# Altium project BMS.PrjPcb
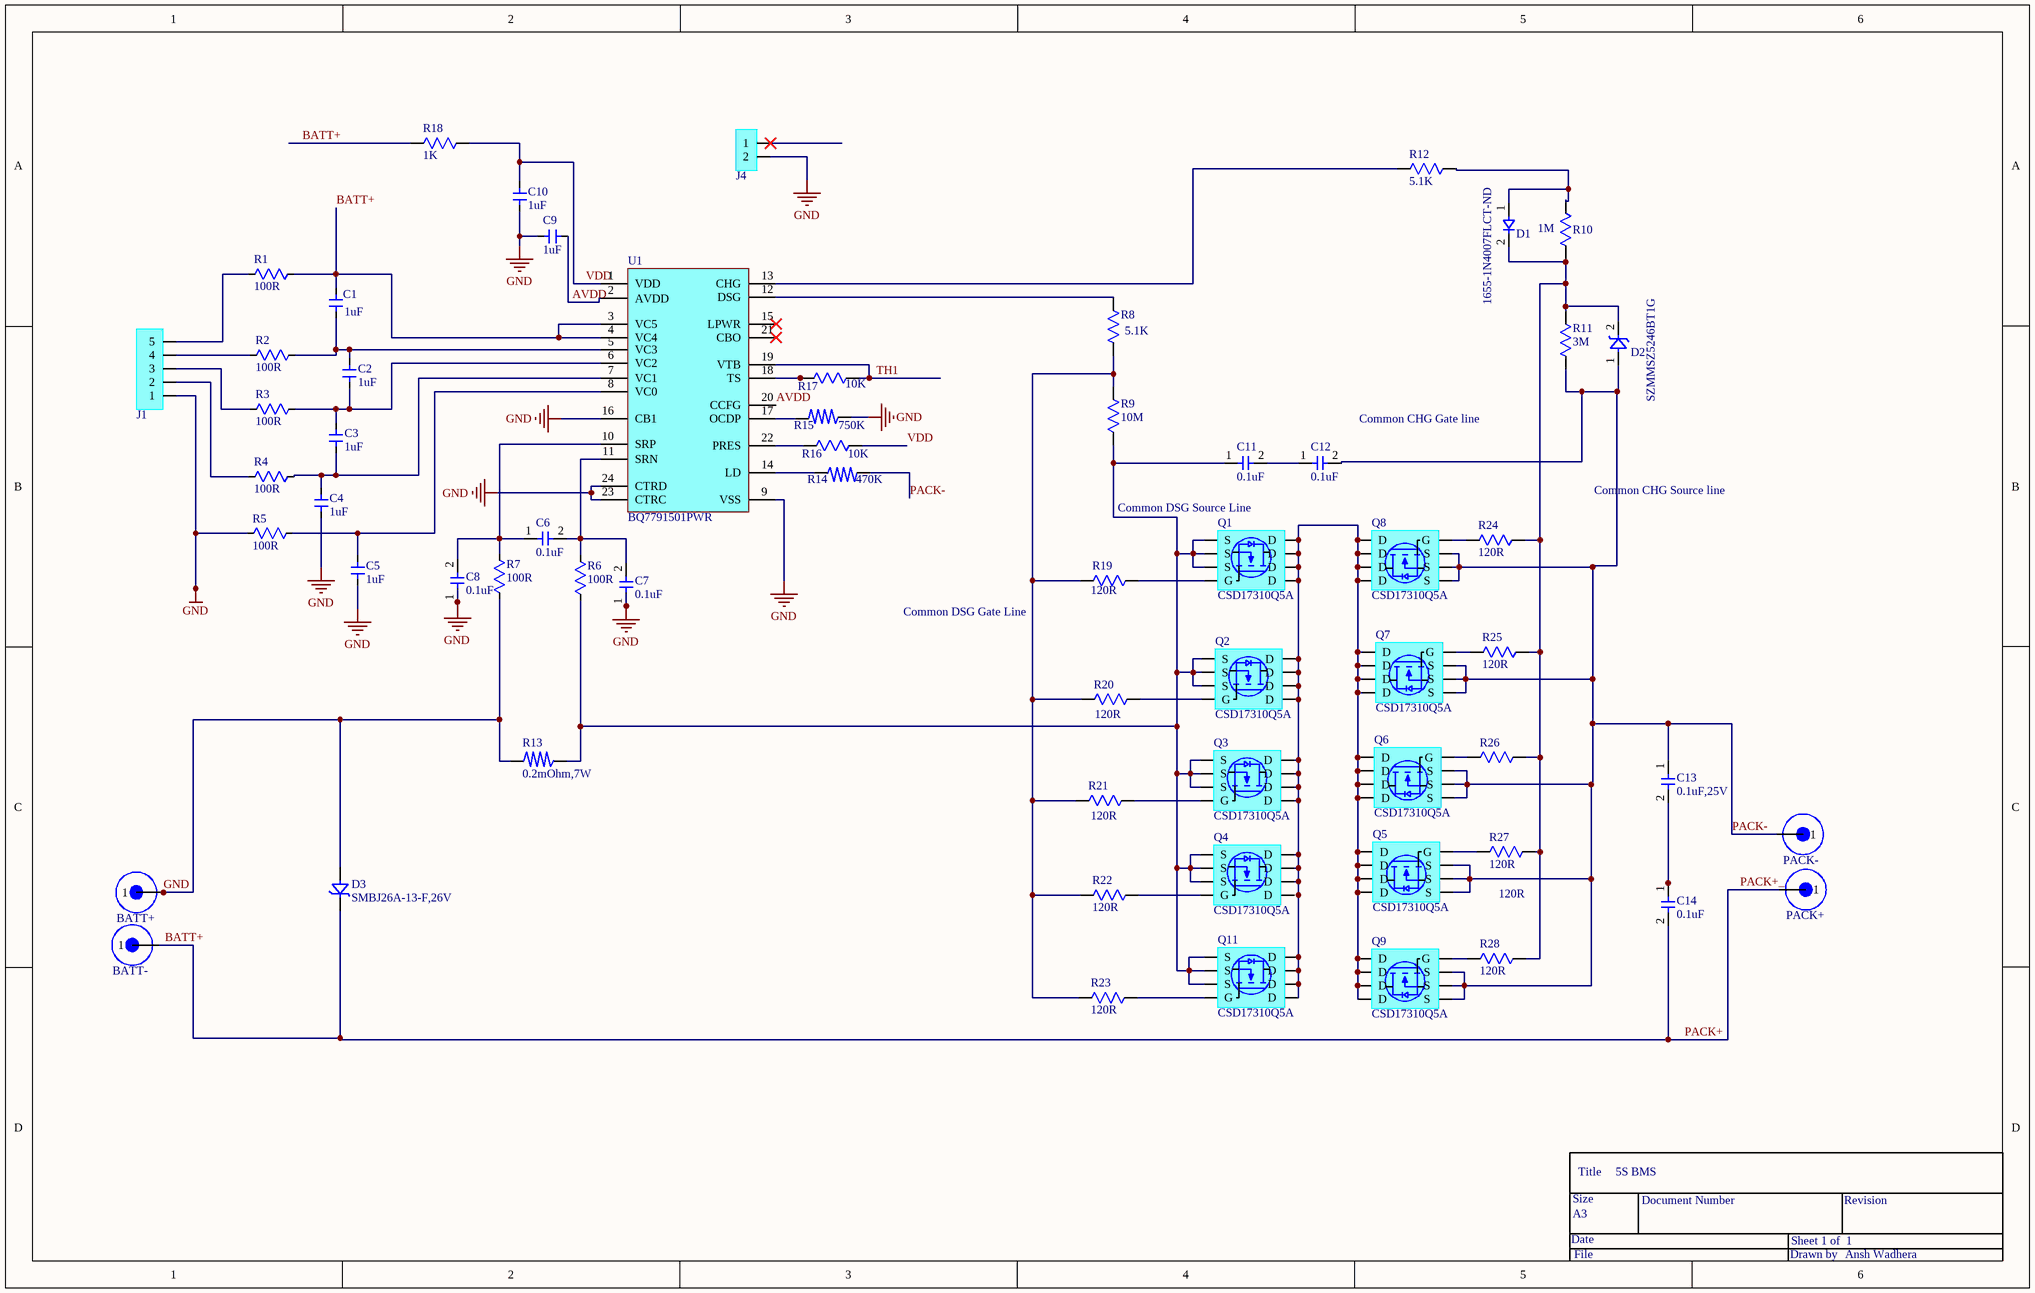
[diagram p0: BMS.SchDoc]
1 sheet, 62 parts. Net scope: global (net labels, ports and power ports of the same name join across sheets).
Board files: BMSrev.PcbDoc, BMSrev2(NEW).PcbDoc, BMS_Rev3.PcbDoc, BMS_Rev4.PcbDoc

## Sheet BMS.SchDoc
size B; SheetNumber: 1; SheetTotal: 1

### Parts
BATT+  Pads  [PadsPack]  (value not drawn)
BATT-  Pads  [PadsPack]  (value not drawn)
C1  1uF  [WCAP-CSGP_0805_L2W1.25H0.6_Wave]
C2  1uF  [WCAP-CSGP_0805_L2W1.25H0.6_Wave]
C3  1uF  [WCAP-CSGP_0805_L2W1.25H0.6_Wave]
C4  1uF  [WCAP-CSGP_0805_L2W1.25H0.6_Wave]
C5  1uF  [WCAP-CSGP_0805_L2W1.25H0.6_Wave]
C6  0.1uF  [WCAP-CSGP_0603_L1.6W0.8H0.8_Wave]
C7  0.1uF  [WCAP-CSGP_0603_L1.6W0.8H0.8_Wave]
C8  0.1uF  [WCAP-CSGP_0603_L1.6W0.8H0.8_Wave]
C9  1uF  [WCAP-CSGP_0805_L2W1.25H0.6_Wave]
C10  1uF  [WCAP-CSGP_0805_L2W1.25H0.6_Wave]
C11  0.1uF  [WCAP-CSGP_0603_L1.6W0.8H0.8_Wave]
C12  0.1uF  [WCAP-CSGP_0603_L1.6W0.8H0.8_Wave]
C13  0.1uF,25V  [WCAP-CSGP_0603_L1.6W0.8H0.8_Wave]
C14  0.1uF  [WCAP-CSGP_0603_L1.6W0.8H0.8_Wave]
D1  1655-1N4007FLCT-ND  [Diode(SOD)]
D2  SZMMSZ5246BT1G  [Zener(SOD123)]
D3  SMBJ26A-13-F,26V  [DIOM5336X250N]
J1  J1
J4  Header  [Header(4pin)]  (value not drawn)
PACK+  Pads  [PadsPack]  (value not drawn)
PACK-  Pads  [PadsPack]  (value not drawn)
Q1  CSD17310Q5A  [MOSFET_CSD19531Q5A]
Q2  CSD17310Q5A  [MOSFET_CSD19531Q5A]
Q3  CSD17310Q5A  [MOSFET_CSD19531Q5A]
Q4  CSD17310Q5A  [MOSFET_CSD19531Q5A]
Q5  CSD17310Q5A  [MOSFET_CSD19531Q5A]
Q6  CSD17310Q5A  [MOSFET_CSD19531Q5A]
Q7  CSD17310Q5A  [MOSFET_CSD19531Q5A]
Q8  CSD17310Q5A  [MOSFET_CSD19531Q5A]
Q9  CSD17310Q5A  [MOSFET_CSD19531Q5A]
Q11  CSD17310Q5A  [MOSFET_CSD19531Q5A]
R1  100R  [RESC3115X65N]
R2  100R  [RESC3115X65N]
R3  100R  [RESC3115X65N]
R4  100R  [RESC3115X65N]
R5  100R  [RESC3115X65N]
R6  100R  [RESC3115X65N]
R7  100R  [RESC3115X65N]
R8  5.1K  [Resistor0805]
R9  10M  [Resistor0805]
R10  1M  [Resistor0805]
R11  3M  [Resistor0805]
R12  5.1K  [Resistor0805]
R13  0.2mOhm,7W  [CSR]
R14  470K  [Resistor0805]
R15  750K  [Resistor0805]
R16  10K  [Resistor0805]
R17  10K  [Resistor0805]
R18  1K  [Resistor0805]
R19  120R  [Resistor0805]
R20  120R  [Resistor0805]
R21  120R  [Resistor0805]
R22  120R  [Resistor0805]
R23  120R  [Resistor0805]
R24  120R  [Resistor0805]
R25  120R  [Resistor0805]
R26  120R  [Resistor0805]
R27  120R  [Resistor0805]
R28  120R  [Resistor0805]
U1  BQ7791501PWR  [BQ77915]

### Nets
GND: BATT+.1 C4.2 C5.1 C7.1 C8.1 C9.1 C10.1 D3.1 J1.1 J4.2 R5.1 R7.1 R13.1 R15.2 U1.9(VSS) U1.16(CB1) U1.23(CTRC) U1.24(CTRD)
AVDD: C9.2 U1.2(AVDD) U1.20(CCFG)
BATT+: BATT-.1 C1.2 C14.2 D3.2 PACK+.1 R1.2 R18.1 U1.3(VC5) U1.4(VC4)  [also labelled PACK+, PACK+_]
PACK-: C12.2 C13.1 D2.1 PACK-.1 Q5.S Q6.S Q7.S Q8.S Q9.S R11.1 R14.1
TH1: R17.2 U1.19(VTB)
VDD: C10.2 R16.2 R18.2 U1.1(VDD)
NetC1_1: C1.1 C2.2 R2.2 U1.5(VC3)
NetC2_1: C2.1 C3.2 R3.2 U1.6(VC2)
NetC3_1: C3.1 C4.1 R4.2 U1.7(VC1)
NetC5_2: C5.2 R5.2 U1.8(VC0)
NetC6_1: C6.1 C8.2 R7.2 U1.10(SRP)
NetC6_2: C6.2 C7.2 R6.2 U1.11(SRN)
NetC11_1: C11.1 Q1.S Q2.S Q3.S Q4.S Q11.S R6.1 R9.1 R13.2
NetC11_2: C11.2 C12.1
NetC13_2: C13.2 C14.1
NetD1_1: D1.1 R10.2 R12.2
NetD1_2: D1.2 D2.2 R10.1 R11.2 R24.2 R25.2 R26.2 R27.2 R28.2
NetJ1_2: J1.2 R4.1
NetJ1_3: J1.3 R3.1
NetJ1_4: J1.4 R2.1
NetJ1_5: J1.5 R1.1
NetQ1_D: Q1.D Q2.D Q3.D Q4.D Q5.D Q6.D Q7.D Q8.D Q9.D Q11.D
NetQ1_G: Q1.G R19.2
NetQ2_G: Q2.G R20.2
NetQ3_G: Q3.G R21.2
NetQ4_G: Q4.G R22.2
NetQ5_G: Q5.G R27.1
NetQ6_G: Q6.G R26.1
NetQ7_G: Q7.G R25.1
NetQ8_G: Q8.G R24.1
NetQ9_G: Q9.G R28.1
NetQ11_G: Q11.G R23.2
NetR8_1: R8.1 R9.2 R19.1 R20.1 R21.1 R22.1 R23.1
NetR8_2: R8.2 U1.12(DSG)
NetR12_1: R12.1 U1.13(CHG)
NetR14_2: R14.2 U1.14(LD)
NetR15_1: R15.1 U1.17(OCDP)
NetR16_1: R16.1 U1.22(PRES)
NetR17_1: R17.1 U1.18(TS)

Not connected (* = marked no-connect by the designer): J4 1*; U1 15(LPWR)* 21(CBO)*

### Notes on the sheet
- (near C12) Common CHG Gate line
- Common CHG Source line
- Common DSG Source Line
- Common DSG Gate Line
- Title
- 5S BMS
- Date
- Size
- A3
- Document Number
- Sheet 1 of  1
- Revision
- File
- Drawn by
- Ansh Wadhera

### Library data of the parts
C1-C5 C9 C10 = C1u0805: Ceramic Capacitor, Multilayer, Ceramic, 16V, 10% +Tol, 10% -Tol, X7R, 15% TC, 1uF, Surface Mount, 0805; Manufacturer: Walsin Technologies; Manufacturer Part Number: 0805B105K160CT; Multilayer: Yes; Supplier: Digikey; Supplier Part Number: 1292-0805B105K160CT-ND; RoHS: Yes; Category: Ceramic Capacitors; Stock: 4261; Pricing: 1=0.1, 10=0.05, 100=0.0295, 1000=0.01909 (USD); Mounting Technology: Surface Mount; Pins: 2; Dielectric Material: Ceramic; Package Shape: Rectangular; Case/Package: 0805; Terminal Finish: Nickel; Min Operating Temperature: -55°C; Max Operating Temperature: 125°C; JESD-609 Code: e3; Value: 1uF; Capacitor Type: Ceramic; Tolerance  (fill in as +-): 10%; Package Style: SMTMeter; Packaging: Tape and Reel; Tolerance (fill in as +-): 10%; Rated DC Voltage (URdc): 16V; Temperature Characteristics Code: X7R; Termination: Wraparound; Length: 2mm; Width: 1.25mm; Height: 1.25mm; RoHS Compliant: Yes; Reach SVHC Compliant: Yes; ComponentLink1URL: https://datasheet.ciiva.com:443/pdfs/VipMasterIC/IC/WATC/WATC-S-A0009550342/WATC-S-A0009550342-1.pdf?src-supplier=IHS+Markit; ComponentLink1Description: https://datasheet.ciiva.com:443/pdfs/VipMasterIC/IC/WATC/WATC-S-A0009550342/WATC-S-A0009550342-1.pdf?src-supplier=IHS+Markit; ComponentLink2URL: http://www.farnell.com/datasheets/2340522.pdf?src-supplier=Farnell; ComponentLink2Description: http://www.farnell.com/datasheets/2340522.pdf?src-supplier=Farnell; ComponentLink3URL: https://datasheet.octopart.com/0805B105K160CT-Walsin-Technologies-datasheet-128065749.pdf?src-supplier=Future+Electronics; ComponentLink3Description: https://datasheet.octopart.com/0805B105K160CT-Walsin-Technologies-datasheet-128065749.pdf?src-supplier=Future+Electronics; ComponentLink4URL: https://datasheet.octopart.com/0805B105K160CT-Walsin-Technologies-datasheet-85392065.pdf?src-supplier=Element14; ComponentLink4Description: https://datasheet.octopart.com/0805B105K160CT-Walsin-Technologies-datasheet-85392065.pdf?src-supplier=Element14; ComponentLink5URL: https://www.verical.com/server-webapp/html/getDatasheet?partID=137112&src-supplier=Verical; ComponentLink5Description: https://www.verical.com/server-webapp/html/getDatasheet?partID=137112&src-supplier=Verical; ComponentLink6URL: https://datasheet.octopart.com/0805B105K160CT-Walsin-Technologies-datasheet-62066062.pdf?src-supplier=TME; ComponentLink6Description: https://datasheet.octopart.com/0805B105K160CT-Walsin-Technologies-datasheet-62066062.pdf?src-supplier=TME; ComponentLink7URL: https://datasheet.octopart.com/0805B105K160CT-Walsin-Technologies-datasheet-136037192.pdf?src-supplier=TECHDesign; ComponentLink7Description: https://datasheet.octopart.com/0805B105K160CT-Walsin-Technologies-datasheet-136037192.pdf?src-supplier=TECHDesign
C6-C8 C11-C14 = C0.1uF0603: Ceramic Capacitor, Multilayer, Ceramic, 16V, 10% +Tol, 10% -Tol, X7R, 15% TC, 0.1uF, Surface Mount, 0603; Manufacturer: Yageo; Manufacturer Part Number: CC0603KRX7R7BB104; Value: 100nF; Multilayer: Yes; Supplier: Future Electronics; Supplier Part Number: 2938116; RoHS: Yes; Category: Ceramic Capacitors; Stock: 532000; Pricing: 4000=0.0024, 16000=0.0023, 40000=0.0022, 100000=0.0022, 160000=0.0021 (USD); Mounting Technology: Surface Mount; Pins: 2; Dielectric Material: Ceramic; Package Shape: Rectangular; Case/Package: 0603; Terminal Finish: Nickel; Min Operating Temperature: -55°C; Max Operating Temperature: 125°C; JESD-609 Code: e3; Capacitor Type: Ceramic; Tolerance  (fill in as +-): 10%; Package Style: SMTMeter; Packaging: Tape and Reel; Tolerance (fill in as +-): 10%; Rated DC Voltage (URdc): 16V; Temperature Characteristics Code: X7R; Termination: Wraparound; Length: 1.6mm; Width: 0.8mm; Height: 0.8mm; Reach SVHC Compliant: Yes; RoHS Compliant: Yes; ComponentLink1URL: https://datasheet.ciiva.com:443/pdfs/VipMasterIC/IC/YAGO/YAGO-S-A0003557223/YAGO-S-A0003557223-1.pdf?src-supplier=IHS+Markit; ComponentLink1Description: https://datasheet.ciiva.com:443/pdfs/VipMasterIC/IC/YAGO/YAGO-S-A0003557223/YAGO-S-A0003557223-1.pdf?src-supplier=IHS+Markit; ComponentLink2URL: https://datasheet.ciiva.com/11786/0900766b80d84f1d-11786077.pdf?src-supplier=Rs; ComponentLink2Description: https://datasheet.ciiva.com/11786/0900766b80d84f1d-11786077.pdf?src-supplier=Rs; ComponentLink3URL: https://datasheet.ciiva.com/8033/70765-8033799.pdf?src-supplier=Element14; ComponentLink3Description: https://datasheet.ciiva.com/8033/70765-8033799.pdf?src-supplier=Element14; ComponentLink4URL: https://datasheet.ciiva.com/7978/1489800-7978141.pdf?src-supplier=Element14; ComponentLink4Description: https://datasheet.ciiva.com/7978/1489800-7978141.pdf?src-supplier=Element14; ComponentLink5URL: https://datasheet.ciiva.com/28450/1489800-28450552.pdf?src-supplier=Element14; ComponentLink5Description: https://datasheet.ciiva.com/28450/1489800-28450552.pdf?src-supplier=Element14; ComponentLink6URL: https://datasheet.ciiva.com/46430/1734573-46430156.pdf?src-supplier=Element14; ComponentLink6Description: https://datasheet.ciiva.com/46430/1734573-46430156.pdf?src-supplier=Element14; ComponentLink7URL: https://datasheet.ciiva.com/144/mlccorderingcode-144183.pdf?src-supplier=Digikey; ComponentLink7Description: https://datasheet.ciiva.com/144/mlccorderingcode-144183.pdf?src-supplier=Digikey; ComponentLink8URL: https://datasheet.ciiva.com/144/mlccorderingcode-144182.pdf?src-supplier=Digikey; ComponentLink8Description: https://datasheet.ciiva.com/144/mlccorderingcode-144182.pdf?src-supplier=Digikey; ComponentLink9URL: https://datasheet.ciiva.com/144/mlccorderingcode-144184.pdf?src-supplier=Digikey; ComponentLink9Description: https://datasheet.ciiva.com/144/mlccorderingcode-144184.pdf?src-supplier=Digikey; ComponentLink10URL: https://datasheet.ciiva.com/8033/1734573-8033797.pdf?src-supplier=Element14; ComponentLink10Description: https://datasheet.ciiva.com/8033/1734573-8033797.pdf?src-supplier=Element14; ComponentLink11URL: https://datasheet.ciiva.com/13395/upy-gphc-x7r-6-3v-to-50v-8-13395674.pdf?src-supplier=Mouser; ComponentLink11Description: https://datasheet.ciiva.com/13395/upy-gphc-x7r-6-3v-to-50v-8-13395674.pdf?src-supplier=Mouser; ComponentLink12URL: https://datasheet.ciiva.com/11464/upy-gphc-x7r-6-3v-to-50v-8-11464735.pdf?src-supplier=Avnet; ComponentLink12Description: https://datasheet.ciiva.com/11464/upy-gphc-x7r-6-3v-to-50v-8-11464735.pdf?src-supplier=Avnet; ComponentLink13URL: https://datasheet.ciiva.com/15165/getdatasheetpartid-63554-15165387.pdf?src-supplier=Verical; ComponentLink13Description: https://datasheet.ciiva.com/15165/getdatasheetpartid-63554-15165387.pdf?src-supplier=Verical
D1 = 1N4007SOD123: Standard Rectifier 1000V SOD-123; Manufacturer: Sangdest Microelectronics; Supplier: Digikey; Supplier Part Number: 1655-1N4007FLCT-ND; Manufacturer Part Number: 1N4007FL; RoHS: No; Category: Rectifier Diodes; Stock: 340272; Pricing: 1=0.13, 10=0.08, 100=0.0493, 500=0.03562, 1000=0.03116 (USD)
D2 = Zener16V: Zener Diode, 16V V(Z), 5%, 0.5W, Silicon, Unidirectional; Manufacturer: ON Semiconductor; Package Body Material: Plastic; Number of Elements: 1; Dynamic Impedance-Max: 17R; Max Power Dissipation: 500mW; Test Current: 7.8mA; Reference Standard: AEC-Q101; Supplier: Arrow Electronics; Supplier Part Number: SZMMSZ5246BT1G; Manufacturer Part Number: SZMMSZ5246BT1G; RoHS: Yes; Category: Zener Diodes; Stock: 21000; Pricing: 1=0.126, 10=0.0807, 100=0.0626, 500=0.0611, 1000=0.0597, 3000=0.0399, 6000=0.0386 (USD); Pins: 2; Package Shape: Rectangular; Terminal Finish: Tin; Diode Element Material: SILICON; Min Operating Temperature: -55°C; Max Operating Temperature: 150°C; JESD-609 Code: e3; Moisture Sensitivity Level: 1; Package Style: SMALL OUTLINEMeter; Surface Mount: Yes; Terminal Form: Gull Wing; Terminal Position: DUAL; Polarity: Unidirectional; Diode Type: ZENER; JESD-30 Code: R-PDSO-G2; Reference Voltage-Nom: 16V; Technology: ZENER; Voltage Tol-Max: 5%; Reach SVHC Compliant: Yes; RoHS Compliant: Yes; ComponentLink1URL: https://datasheet.ciiva.com:443/pdfs/VipMasterIC/IC/ONSM/ONSM-S-A0008364085/ONSM-S-A0008364085-1.pdf?src-supplier=IHS+Markit; ComponentLink1Description: https://datasheet.ciiva.com:443/pdfs/VipMasterIC/IC/ONSM/ONSM-S-A0008364085/ONSM-S-A0008364085-1.pdf?src-supplier=IHS+Markit; ComponentLink2URL: https://datasheet.ciiva.com/10638/mmsz5221bt1-d-10638284.pdf?src-supplier=Avnet; ComponentLink2Description: https://datasheet.ciiva.com/10638/mmsz5221bt1-d-10638284.pdf?src-supplier=Avnet; ComponentLink3URL: https://datasheet.ciiva.com/900/mmsz5221bt1-d-900242.pdf?src-supplier=Digikey; ComponentLink3Description: https://datasheet.ciiva.com/900/mmsz5221bt1-d-900242.pdf?src-supplier=Digikey
D3 = Diode(26V): Trans Voltage Suppressor Diode, 600W, 26V V(RWM), Unidirectional, 1 Element, Silicon; Manufacturer: Diodes; Package Body Material: Plastic; Additional Feature: EXCELLENT CLAMPING CAPABILITY; Max Breakdown Voltage: 33.2V; Min Breakdown Voltage: 28.9V; Breakdown Voltage-Nom: 31.05V; Clamping Voltage-Max: 42.1V; Number of Elements: 1; Max Power Dissipation: 5W; Time @ Peak Reflow Temperature-Max (s): 40s; Qualification Status: Not Qualified; Supplier: Arrow Electronics; Supplier Part Number: SMBJ26A-13-F; Manufacturer Part Number: SMBJ26A-13-F; RoHS: Yes; Category: TVS Diodes; Stock: 43; Pricing: 43=0.1066 (USD); Pins: 2; Diode Element Material: SILICON; Package Shape: Rectangular; Terminal Finish: Tin; Min Operating Temperature: -55°C; Max Operating Temperature: 150°C; JESD-609 Code: e3; Polarity: Unidirectional; Diode Type: TRANS VOLTAGE SUPPRESSOR; JESD-30 Code: R-PDSO-C2; Moisture Sensitivity Level: 1; Non-rep Peak Rev Power Dis-Max: 600W; Package Style: SMALL OUTLINEMeter; Peak Reflow Temperature (Cel): 260°C; Rep Pk Reverse Voltage-Max: 26V; Surface Mount: Yes; Technology: AVALANCHE; Terminal Form: C BEND; Terminal Position: DUAL; RoHS Compliant: Yes; Reach SVHC Compliant: No; ComponentLink1URL: https://datasheet.ciiva.com:443/pdfs/VipMasterIC/IC/DIOD/DIOD-S-A0003133144/DIOD-S-A0003133144-1.pdf?src-supplier=IHS+Markit; ComponentLink1Description: https://datasheet.ciiva.com:443/pdfs/VipMasterIC/IC/DIOD/DIOD-S-A0003133144/DIOD-S-A0003133144-1.pdf?src-supplier=IHS+Markit; ComponentLink2URL: http://www.mouser.com/ds/2/115/ds19002-13254.pdf?src-supplier=Mouser; ComponentLink2Description: http://www.mouser.com/ds/2/115/ds19002-13254.pdf?src-supplier=Mouser; ComponentLink3URL: https://datasheet.octopart.com/SMBJ26A-13-F-Diodes-Inc.-datasheet-4062.pdf?src-supplier=Digikey; ComponentLink3Description: https://datasheet.octopart.com/SMBJ26A-13-F-Diodes-Inc.-datasheet-4062.pdf?src-supplier=Digikey; ComponentLink4URL: https://www.diodes.com/assets/Datasheets/ds19002.pdf?src-supplier=Digikey; ComponentLink4Description: https://www.diodes.com/assets/Datasheets/ds19002.pdf?src-supplier=Digikey; ComponentLink5URL: http://components.arrow.com/part/dataview/41509992S7614743N2867?src-supplier=Arrow+Electronics; ComponentLink5Description: http://components.arrow.com/part/dataview/41509992S7614743N2867?src-supplier=Arrow+Electronics; ComponentLink6URL: http://www.diodes.com//datasheets/ds19002.pdf?src-supplier=Avnet; ComponentLink6Description: http://www.diodes.com//datasheets/ds19002.pdf?src-supplier=Avnet; ComponentLink7URL: http://www.diodes.com///datasheets/ds19002.pdf?src-supplier=Avnet; ComponentLink7Description: http://www.diodes.com///datasheets/ds19002.pdf?src-supplier=Avnet; ComponentLink8URL: https://datasheet.octopart.com/SMBJ26A-13-F-Diodes-Inc.-datasheet-103923734.pdf?src-supplier=Farnell; ComponentLink8Description: https://datasheet.octopart.com/SMBJ26A-13-F-Diodes-Inc.-datasheet-103923734.pdf?src-supplier=Farnell
J1 = Header(6pin)
J4 = Header(4Pin)
Q1-Q9 Q11 = Power Mosfet: Power Field-Effect Transistor, 100A I(D), 30V, 0.0078ohm, 1-Element, N-Channel, Silicon, Metal-oxide Semiconductor FET; Manufacturer: Texas Instruments; Package Body Material: Plastic; Avalanche Energy Rating (Eas): 168mJ; Case Connection: DRAIN; Drain-source On Resistance-Max: 7.8mR; Number of Elements: 1; Operating Mode: ENHANCEMENT MODE; Power Dissipation-Max (Abs): 3.1W; Pulsed Drain Current-Max (IDM): 134A; Transistor Application: SWITCHING; Qualification Status: Not Qualified; Supplier: Mouser; Supplier Part Number: 595-CSD17310Q5A; Manufacturer Part Number: CSD17310Q5A; RoHS: Yes; Category: Integrated Circuits (ICs); Stock: 5509; Pricing: 1=0.55, 10=0.537, 50=0.537, 100=0.478, 1000=0.403, 10000=0.361 (USD); ComponentLink1URL: https://www.ti.com:443/lit/ds/symlink/csd17310q5a.pdf?src-supplier=IHS+Markit; ComponentLink1Description: https://www.ti.com:443/lit/ds/symlink/csd17310q5a.pdf?src-supplier=IHS+Markit; ComponentLink2URL: https://datasheet.ciiva.com/938/csd17310q5a-938736.pdf?src-supplier=Digikey; ComponentLink2Description: https://datasheet.ciiva.com/938/csd17310q5a-938736.pdf?src-supplier=Digikey; Pins: 5; Package Shape: Rectangular; Terminal Finish: Tin; Transistor Element Material: SILICON; Max Operating Temperature: 150°C; JESD-609 Code: e3; Polarity/Channel Type: N-CHANNEL; Drain Current-Max (Abs) (ID): 100A; Drain Current-Max (ID): 100A; DS Breakdown Voltage-Min: 30V; FET Technology: METAL-OXIDE SEMICONDUCTOR; Moisture Sensitivity Level: 1; Package Style: SMALL OUTLINEMeter; Peak Reflow Temperature (Cel): 260°C; Surface Mount: Yes; Terminal Form: No Lead; Terminal Position: DUAL; RoHS Compliant: Yes; Reach SVHC Compliant: No; ComponentLink3URL: https://datasheet.ciiva.com/14423/slps255a-14423506.pdf?src-supplier=Avnet; ComponentLink3Description: https://datasheet.ciiva.com/14423/slps255a-14423506.pdf?src-supplier=Avnet; ComponentLink4URL: https://datasheet.ciiva.com/4440/slps255a-128076-4440500.pdf?src-supplier=Mouser; ComponentLink4Description: https://datasheet.ciiva.com/4440/slps255a-128076-4440500.pdf?src-supplier=Mouser; ComponentLink5URL: https://datasheet.ciiva.com/7968/1788987-7968276.pdf?src-supplier=Element14; ComponentLink5Description: https://datasheet.ciiva.com/7968/1788987-7968276.pdf?src-supplier=Element14; ComponentLink6URL: https://datasheet.ciiva.com/938/csd17310q5a-938737.pdf?src-supplier=Digikey; ComponentLink6Description: https://datasheet.ciiva.com/938/csd17310q5a-938737.pdf?src-supplier=Digikey; ComponentLink7URL: https://datasheet.ciiva.com/938/csd17310q5a-938738.pdf?src-supplier=Digikey; ComponentLink7Description: https://datasheet.ciiva.com/938/csd17310q5a-938738.pdf?src-supplier=Digikey; ComponentLink8URL: https://datasheet.ciiva.com/5751/csd17310q5a-5751786.pdf?src-supplier=Farnell; ComponentLink8Description: https://datasheet.ciiva.com/5751/csd17310q5a-5751786.pdf?src-supplier=Farnell; ComponentLink9URL: https://datasheet.ciiva.com/14192/slps255a-14192902.pdf?src-supplier=Avnet; ComponentLink9Description: https://datasheet.ciiva.com/14192/slps255a-14192902.pdf?src-supplier=Avnet
R1-R7 = 100R1206: Fixed Resistor, Metal Foil, 0.25W, 100ohm, 79V, 0.02% +/-Tol, 0.2ppm/Cel, Surface Mount, 1206; Manufacturer: Vishay Precision Group; Manufacturer Part Number: Y1630100R000Q9R; Manufacturer Series: VFCP; Power: 250mW; Rated Temperature: 70°C; Temperature Coefficient (ppm/Cel): .2; Package Height: 0.64mm; Package Length: 3.2mm; Package Width: 1.57mm; Supplier: Avnet; Supplier Part Number: Y1630100R000Q9R; RoHS: Yes; Category: Chip SMD Resistors; Pricing: 100=9.3023, 200=9.1665, 400=9.0307, 600=5.3841, 800=5.2374 (USD); Mounting Technology: Surface Mount; Pins: 2; Case/Package: 1206; Package Shape: Rectangular; Terminal Finish: Copper; Min Operating Temperature: -55°C; Max Operating Temperature: 150°C; Tolerance: 0.02%; Resistor Type: FIXED RESISTOR; Construction: Rectangular; Packaging: Tape and Reel; Value: 100R; Technology: METAL FOIL; Working Voltage: 79V; JESD-609 Code: e1; Termination: One Surface; RoHS Compliant: Yes; Reach SVHC Compliant: Yes; ComponentLink1URL: https://datasheet.ciiva.com:443/pdfs/VipMasterIC/IC/VIPG/VIPG-S-A0001709419/VIPG-S-A0001709419-1.pdf?src-supplier=IHS+Markit; ComponentLink1Description: https://datasheet.ciiva.com:443/pdfs/VipMasterIC/IC/VIPG/VIPG-S-A0001709419/VIPG-S-A0001709419-1.pdf?src-supplier=IHS+Markit; ComponentLink2URL: https://datasheet.ciiva.com/29710/vfcpseri-29710815.pdf?src-supplier=Digikey; ComponentLink2Description: https://datasheet.ciiva.com/29710/vfcpseri-29710815.pdf?src-supplier=Digikey; ComponentLink3URL: https://datasheet.ciiva.com/25647/vfcpseri-25647597.pdf?src-supplier=Digikey; ComponentLink3Description: https://datasheet.ciiva.com/25647/vfcpseri-25647597.pdf?src-supplier=Digikey; ComponentLink4URL: https://datasheet.ciiva.com/18609/vfcpseri-18609260.pdf?src-supplier=Digikey; ComponentLink4Description: https://datasheet.ciiva.com/18609/vfcpseri-18609260.pdf?src-supplier=Digikey
R8 R12 = 5.1K0805: Fixed Resistor, Metal Glaze/thick Film, 0.125W, 5100ohm, 150V, 5% +/-Tol, 200ppm/Cel, Surface Mount, 0805; Manufacturer: Stackpole Electronics; Manufacturer Part Number: RMCF0805JT5K10; Power: 125mW; Rated Temperature: 70°C; Value: 5.1kR; Temperature Coefficient (ppm/Cel): 200; Package Height: 0.5mm; Package Length: 2mm; Package Width: 1.25mm; Reference Standard: AEC-Q200; Supplier: Digikey; Supplier Part Number: RMCF0805JT5K10CT-ND; RoHS: Yes; Category: Chip SMD Resistors; Stock: 398574; Pricing: 1=0.1, 10=0.022, 50=0.0126, 100=0.0101, 500=0.00644, 1000=0.00542 (USD); Mounting Technology: Surface Mount; Pins: 2; Package Shape: Rectangular; Case/Package: 0805; Terminal Finish: Nickel; Min Operating Temperature: -55°C; Max Operating Temperature: 155°C; Tolerance: 5%; JESD-609 Code: e3; Resistor Type: FIXED RESISTOR; Construction: Rectangular; Packaging: Tape and Reel; Technology: METAL GLAZE/THICK FILM; Termination: Wraparound; Working Voltage: 150V; Reach SVHC Compliant: Yes; RoHS Compliant: Yes; ComponentLink1URL: https://datasheet.ciiva.com:443/pdfs/VipMasterIC/IC/SEIE/SEIE-S-A0009541969/SEIE-S-A0009541969-1.pdf?src-supplier=IHS+Markit; ComponentLink1Description: https://datasheet.ciiva.com:443/pdfs/VipMasterIC/IC/SEIE/SEIE-S-A0009541969/SEIE-S-A0009541969-1.pdf?src-supplier=IHS+Markit; ComponentLink2URL: https://datasheet.ciiva.com/15193/getdatasheetpartid-707422-15193654.pdf?src-supplier=Verical; ComponentLink2Description: https://datasheet.ciiva.com/15193/getdatasheetpartid-707422-15193654.pdf?src-supplier=Verical
R10 = 1M0805: Fixed Resistor, Thin Film, 0.125W, 1000000ohm, 150V, 0.1% +/-Tol, 25ppm/Cel, Surface Mount, 0805; Manufacturer: Susumu; Manufacturer Part Number: RG2012P-105-B-T5; Additional Feature: ANTI-SULFUR, PRECISION; Power: 250mW; Rated Temperature: 70°C; Value: 1MR; Temperature Coefficient (ppm/Cel): 25; Package Height: 0.4mm; Package Length: 2mm; Package Width: 1.25mm; Reference Standard: AEC-Q200; Supplier: Digikey; Supplier Part Number: 408-RG2012P-105-B-T5CT-ND; RoHS: Yes; Category: Chip SMD Resistors; Stock: 88488; Pricing: 1=0.12, 10=0.1, 50=0.0876, 100=0.0828, 500=0.07762, 1000=0.07201 (USD); Mounting Technology: Surface Mount; Pins: 2; Case/Package: 0805; Terminal Finish: Nickel; Min Operating Temperature: -55°C; Max Operating Temperature: 155°C; Tolerance: 0.1%; JESD-609 Code: e3; Resistor Type: FIXED RESISTOR; Construction: Rectangular; Packaging: Tape and Reel; Technology: THIN FILM; Termination: Wraparound; Working Voltage: 150V; Reach SVHC Compliant: Yes; RoHS Compliant: Yes; ComponentLink1URL: https://datasheet.ciiva.com:443/pdfs/VipMasterIC/IC/SUSU/SUSU-S-A0004582566/SUSU-S-A0004582566-1.pdf?src-supplier=IHS+Markit; ComponentLink1Description: https://datasheet.ciiva.com:443/pdfs/VipMasterIC/IC/SUSU/SUSU-S-A0004582566/SUSU-S-A0004582566-1.pdf?src-supplier=IHS+Markit; ComponentLink2URL: https://media.digikey.com/pdf/Data%20Sheets/Susumu%20PDFs/RG_RM_RGH_Oct2012.pdf?src-supplier=Digikey; ComponentLink2Description: https://media.digikey.com/pdf/Data%20Sheets/Susumu%20PDFs/RG_RM_RGH_Oct2012.pdf?src-supplier=Digikey; ComponentLink3URL: http://www.mouser.com/ds/2/392/n_catalog_partition01_en-1140338.pdf?src-supplier=Mouser; ComponentLink3Description: http://www.mouser.com/ds/2/392/n_catalog_partition01_en-1140338.pdf?src-supplier=Mouser; ComponentLink4URL: https://4donline.ihs.com/images/VipMasterIC/IC/SUSU/SUSU-S-A0004582566/SUSU-S-A0004582566-1.pdf?hkey=52A5661711E402568146F3353EA87419&src-supplier=Newark; ComponentLink4Description: https://4donline.ihs.com/images/VipMasterIC/IC/SUSU/SUSU-S-A0004582566/SUSU-S-A0004582566-1.pdf?hkey=52A5661711E402568146F3353EA87419&src-supplier=Newark; ComponentLink5URL: http://www.susumu.co.jp/common/pdf/n_catalog_partition01_en.pdf?src-supplier=Digikey; ComponentLink5Description: http://www.susumu.co.jp/common/pdf/n_catalog_partition01_en.pdf?src-supplier=Digikey; ComponentLink6URL: https://4donline.ihs.com/images/VipMasterIC/IC/SUSU/SUSU-S-A0004582566/SUSU-S-A0004582566-1.pdf?hkey=52A5661711E402568146F3353EA87419&src-supplier=Farnell; ComponentLink6Description: https://4donline.ihs.com/images/VipMasterIC/IC/SUSU/SUSU-S-A0004582566/SUSU-S-A0004582566-1.pdf?hkey=52A5661711E402568146F3353EA87419&src-supplier=Farnell; ComponentLink7URL: https://4donline.ihs.com/images/VipMasterIC/IC/SUSU/SUSU-S-A0004582566/SUSU-S-A0004582566-1.pdf?hkey=52A5661711E402568146F3353EA87419&src-supplier=Element14; ComponentLink7Description: https://4donline.ihs.com/images/VipMasterIC/IC/SUSU/SUSU-S-A0004582566/SUSU-S-A0004582566-1.pdf?hkey=52A5661711E402568146F3353EA87419&src-supplier=Element14; ComponentLink8URL: https://datasheet.octopart.com/RG2012P-105-B-T5-Susumu-datasheet-68296037.pdf?src-supplier=Future+Electronics; ComponentLink8Description: https://datasheet.octopart.com/RG2012P-105-B-T5-Susumu-datasheet-68296037.pdf?src-supplier=Future+Electronics
R11 = 3M0805: Fixed Resistor, Metal Glaze/thick Film, 0.125W, 3000000ohm, 150V, 5% +/-Tol, 100ppm/Cel, Surface Mount, 0805; Manufacturer: Yageo; Manufacturer Part Number: RC0805JR-073ML; Additional Feature: LASER TRIMMABLE; Power: 125mW; Rated Temperature: 70°C; Value: 3MR; Temperature Coefficient (ppm/Cel): 100; Package Height: 0.5mm; Package Length: 2mm; Package Width: 1.25mm; Supplier: Future Electronics; Supplier Part Number: 1166535; RoHS: Yes; Category: Chip SMD Resistors; Stock: 225000; Pricing: 5000=0.0019, 20000=0.0019, 100000=0.0018, 200000=0.0017, 625000=0.0017 (USD); Mounting Technology: Surface Mount; Pins: 2; Package Shape: Rectangular; Case/Package: 0805; Terminal Finish: Nickel; Min Operating Temperature: -55°C; Max Operating Temperature: 155°C; Tolerance: 5%; JESD-609 Code: e3; Resistor Type: FIXED RESISTOR; Construction: Chip; Packaging: Tape and Reel; Technology: METAL GLAZE/THICK FILM; Termination: Wraparound; Working Voltage: 150V; Reach SVHC Compliant: Yes; RoHS Compliant: Yes; ComponentLink1URL: https://datasheet.ciiva.com:443/pdfs/VipMasterIC/IC/YAGO/YAGO-S-A0008145938/YAGO-S-A0008145938-1.pdf?src-supplier=IHS+Markit; ComponentLink1Description: https://datasheet.ciiva.com:443/pdfs/VipMasterIC/IC/YAGO/YAGO-S-A0008145938/YAGO-S-A0008145938-1.pdf?src-supplier=IHS+Markit; ComponentLink2URL: https://datasheet.ciiva.com/2491/pyu-r-int-thick-7-2491360.pdf?src-supplier=Digikey; ComponentLink2Description: https://datasheet.ciiva.com/2491/pyu-r-int-thick-7-2491360.pdf?src-supplier=Digikey; ComponentLink3URL: https://datasheet.ciiva.com/2491/pyu-r-int-thick-7-2491361.pdf?src-supplier=Digikey; ComponentLink3Description: https://datasheet.ciiva.com/2491/pyu-r-int-thick-7-2491361.pdf?src-supplier=Digikey; ComponentLink4URL: https://datasheet.ciiva.com/2491/pyu-r-int-thick-7-2491362.pdf?src-supplier=Digikey; ComponentLink4Description: https://datasheet.ciiva.com/2491/pyu-r-int-thick-7-2491362.pdf?src-supplier=Digikey; ComponentLink5URL: https://datasheet.ciiva.com/17422/rc0805-17422951.pdf?src-supplier=Future+Electronics; ComponentLink5Description: https://datasheet.ciiva.com/17422/rc0805-17422951.pdf?src-supplier=Future+Electronics
R13 = CSR: Fixed Resistor, Metal Strip, 7W, 0.0002ohm, 0.0374V, 1% +/-Tol, 225ppm/Cel, Surface Mount, 5931; Manufacturer: Yageo; Manufacturer Part Number: PU5931FKHP70U2L; Rated Temperature: 70°C; Value: 0.2mR; Temperature Coefficient (ppm/Cel): 225; Package Length: 15mm; Package Width: 7.75mm; Reference Standard: AEC-Q200; Supplier: Digikey; Supplier Part Number: YAG6135CT-ND; RoHS: Yes; Category: Chip SMD Resistors; Stock: 490; Pricing: 1=2.31, 10=1.536, 25=1.3252, 50=1.1936, 100=1.0814, 250=0.9586, 500=0.88176 (USD); Mounting Technology: Surface Mount; Pins: 2; Case/Package: 5931; Min Operating Temperature: -65°C; Max Operating Temperature: 170°C; Tolerance: 1%; Resistor Type: FIXED RESISTOR; Construction: Molded; Packaging: Tape and Reel; Power: 7W; Technology: METAL STRIP; Termination: Gull Wing; Reach SVHC Compliant: Yes; RoHS Compliant: Yes; ComponentLink1URL: https://datasheet.ciiva.com:443/pdfs/VipMasterIC/IC/YAGO/YAGO-S-A0007059195/YAGO-S-A0007059195-1.pdf?src-supplier=IHS+Markit; ComponentLink1Description: https://datasheet.ciiva.com:443/pdfs/VipMasterIC/IC/YAGO/YAGO-S-A0007059195/YAGO-S-A0007059195-1.pdf?src-supplier=IHS+Markit
R14 = 470K: Fixed Resistor, Metal Glaze/thick Film, 0.125W, 470000ohm, 150V, 1% +/-Tol, 100ppm/Cel, Surface Mount, 0805; Manufacturer: Yageo; Manufacturer Part Number: RC0805FR-0747KL; Additional Feature: LASER TRIMMABLE; Power: 125mW; Rated Temperature: 70°C; Value: 47kR; Temperature Coefficient (ppm/Cel): 100; Package Height: 0.5mm; Package Length: 2mm; Package Width: 1.25mm; Supplier: Future Electronics; Supplier Part Number: 2357531; RoHS: Yes; Category: Chip SMD Resistors; Stock: 360000; Pricing: 5000=0.0016, 25000=0.0015, 100000=0.0015, 250000=0.0014, 625000=0.0014 (USD); Mounting Technology: Surface Mount; Pins: 2; Package Shape: Rectangular; Case/Package: 0805; Terminal Finish: Nickel; Min Operating Temperature: -55°C; Max Operating Temperature: 155°C; Tolerance: 1%; Termination: Wraparound; JESD-609 Code: e3; Resistor Type: FIXED RESISTOR; Construction: Chip; Packaging: Tape and Reel; Technology: METAL GLAZE/THICK FILM; Working Voltage: 150V; Reach SVHC Compliant: Yes; RoHS Compliant: Yes; ComponentLink1URL: https://datasheet.ciiva.com:443/pdfs/VipMasterIC/IC/YAGO/YAGO-S-A0008145938/YAGO-S-A0008145938-1.pdf?src-supplier=IHS+Markit; ComponentLink1Description: https://datasheet.ciiva.com:443/pdfs/VipMasterIC/IC/YAGO/YAGO-S-A0008145938/YAGO-S-A0008145938-1.pdf?src-supplier=IHS+Markit; ComponentLink2URL: https://datasheet.ciiva.com/46447/444164-46447581.pdf?src-supplier=Element14; ComponentLink2Description: https://datasheet.ciiva.com/46447/444164-46447581.pdf?src-supplier=Element14; ComponentLink3URL: https://datasheet.ciiva.com/7941/1686128-7941799.pdf?src-supplier=Element14; ComponentLink3Description: https://datasheet.ciiva.com/7941/1686128-7941799.pdf?src-supplier=Element14; ComponentLink4URL: https://datasheet.ciiva.com/7941/444164-7941800.pdf?src-supplier=Element14; ComponentLink4Description: https://datasheet.ciiva.com/7941/444164-7941800.pdf?src-supplier=Element14; ComponentLink5URL: https://datasheet.ciiva.com/7941/444164-7941801.pdf?src-supplier=Element14; ComponentLink5Description: https://datasheet.ciiva.com/7941/444164-7941801.pdf?src-supplier=Element14; ComponentLink6URL: https://datasheet.ciiva.com/16742/rc0805-16742265.pdf?src-supplier=Future+Electronics; ComponentLink6Description: https://datasheet.ciiva.com/16742/rc0805-16742265.pdf?src-supplier=Future+Electronics; ComponentLink7URL: https://datasheet.ciiva.com/12667/rc0805-12667926.pdf?src-supplier=Mouser; ComponentLink7Description: https://datasheet.ciiva.com/12667/rc0805-12667926.pdf?src-supplier=Mouser
R15 = 750K: Fixed Resistor, Metal Glaze/thick Film, 0.125W, 750000ohm, 150V, 1% +/-Tol, 100ppm/Cel, Surface Mount, 0805; Manufacturer: Stackpole Electronics; Manufacturer Part Number: RMCF0805FT750K; Power: 125mW; Rated Temperature: 70°C; Value: 750kR; Temperature Coefficient (ppm/Cel): 100; Package Height: 0.5mm; Package Length: 2mm; Package Width: 1.25mm; Reference Standard: AEC-Q200; Supplier: Digikey; Supplier Part Number: RMCF0805FT750KCT-ND; RoHS: Yes; Category: Chip SMD Resistors; Stock: 25527; Pricing: 1=0.1, 10=0.025, 100=0.012, 1000=0.00658, 2500=0.00538 (USD); Mounting Technology: Surface Mount; Pins: 2; Package Shape: Rectangular; Case/Package: 0805; Terminal Finish: Nickel; Min Operating Temperature: -55°C; Max Operating Temperature: 155°C; Tolerance: 1%; JESD-609 Code: e3; Resistor Type: FIXED RESISTOR; Construction: Rectangular; Packaging: Tape and Reel; Technology: METAL GLAZE/THICK FILM; Termination: Wraparound; Working Voltage: 150V; Reach SVHC Compliant: Yes; RoHS Compliant: Yes; ComponentLink1URL: https://datasheet.ciiva.com:443/pdfs/VipMasterIC/IC/SEIE/SEIE-S-A0009541969/SEIE-S-A0009541969-1.pdf?src-supplier=IHS+Markit; ComponentLink1Description: https://datasheet.ciiva.com:443/pdfs/VipMasterIC/IC/SEIE/SEIE-S-A0009541969/SEIE-S-A0009541969-1.pdf?src-supplier=IHS+Markit; ComponentLink2URL: http://components.arrow.com/part/dataview/40964641S7404118N1174?src-supplier=Arrow+Electronics; ComponentLink2Description: http://components.arrow.com/part/dataview/40964641S7404118N1174?src-supplier=Arrow+Electronics; ComponentLink3URL: https://www.verical.com/server-webapp/html/getDatasheet?partID=494680&src-supplier=Verical; ComponentLink3Description: https://www.verical.com/server-webapp/html/getDatasheet?partID=494680&src-supplier=Verical; ComponentLink4URL: https://www.seielect.com/catalog/sei-rmcf_rmcp.pdf?src-supplier=Digikey; ComponentLink4Description: https://www.seielect.com/catalog/sei-rmcf_rmcp.pdf?src-supplier=Digikey; ComponentLink5URL: https://www.seielect.com/catalog/SEI-Packaging.pdf?src-supplier=Digikey; ComponentLink5Description: https://www.seielect.com/catalog/SEI-Packaging.pdf?src-supplier=Digikey; ComponentLink6URL: https://www.seielect.com/catalog/SEI-RMCF_RMCP.pdf?src-supplier=Avnet; ComponentLink6Description: https://www.seielect.com/catalog/SEI-RMCF_RMCP.pdf?src-supplier=Avnet; ComponentLink7URL: https://datasheet.octopart.com/RMCF0805FT750K-Stackpole-Electronics-datasheet-141193804.pdf?src-supplier=Master+Electronics; ComponentLink7Description: https://datasheet.octopart.com/RMCF0805FT750K-Stackpole-Electronics-datasheet-141193804.pdf?src-supplier=Master+Electronics
R16 R17 = 10K: Fixed Resistor, Metal Glaze/thick Film, 0.0625W, 10000ohm, 50V, 5% +/-Tol, 100ppm/Cel, Surface Mount, 0402; Manufacturer: Yageo; Manufacturer Part Number: RC0402JR-0710KL; Additional Feature: LASER TRIMMABLE; Power: 62.5mW; Rated Temperature: 70°C; Value: 10kR; Temperature Coefficient (ppm/Cel): 100; Package Height: 0.35mm; Package Length: 1mm; Package Width: 0.5mm; Supplier: Future Electronics; Supplier Part Number: 4356762; RoHS: Yes; Category: Chip SMD Resistors; Stock: 980000; Pricing: 10000=0.0003, 50000=0.0003, 200000=0.0003, 500000=0.0003, 1250000=0.0003 (USD); Mounting Technology: Surface Mount; Pins: 2; Package Shape: Rectangular; Case/Package: 0402; Terminal Finish: Nickel; Min Operating Temperature: -55°C; Max Operating Temperature: 155°C; Tolerance: 5%; JESD-609 Code: e3; Resistor Type: FIXED RESISTOR; Construction: Chip; Packaging: Tape and Reel; Technology: METAL GLAZE/THICK FILM; Termination: Wraparound; Working Voltage: 50V; Reach SVHC Compliant: Yes; RoHS Compliant: Yes; ComponentLink1URL: https://datasheet.ciiva.com:443/pdfs/VipMasterIC/IC/YAGO/YAGO-S-A0008145938/YAGO-S-A0008145938-1.pdf?src-supplier=IHS+Markit; ComponentLink1Description: https://datasheet.ciiva.com:443/pdfs/VipMasterIC/IC/YAGO/YAGO-S-A0008145938/YAGO-S-A0008145938-1.pdf?src-supplier=IHS+Markit; ComponentLink2URL: https://datasheet.ciiva.com/2452/pyu-r-int-thick-7-2452627.pdf?src-supplier=Digikey; ComponentLink2Description: https://datasheet.ciiva.com/2452/pyu-r-int-thick-7-2452627.pdf?src-supplier=Digikey; ComponentLink3URL: https://datasheet.ciiva.com/2452/pyu-r-int-thick-7-2452628.pdf?src-supplier=Digikey; ComponentLink3Description: https://datasheet.ciiva.com/2452/pyu-r-int-thick-7-2452628.pdf?src-supplier=Digikey; ComponentLink4URL: https://datasheet.ciiva.com/2452/pyu-r-int-thick-7-2452626.pdf?src-supplier=Digikey; ComponentLink4Description: https://datasheet.ciiva.com/2452/pyu-r-int-thick-7-2452626.pdf?src-supplier=Digikey; ComponentLink5URL: https://datasheet.ciiva.com/12669/pyu-rc0402-51-rohs-l-6-r-12669687.pdf?src-supplier=Mouser; ComponentLink5Description: https://datasheet.ciiva.com/12669/pyu-rc0402-51-rohs-l-6-r-12669687.pdf?src-supplier=Mouser; ComponentLink6URL: https://datasheet.ciiva.com/7850/1018594-7850137.pdf?src-supplier=Element14; ComponentLink6Description: https://datasheet.ciiva.com/7850/1018594-7850137.pdf?src-supplier=Element14; ComponentLink7URL: https://datasheet.ciiva.com/7850/1018594-7850136.pdf?src-supplier=Element14; ComponentLink7Description: https://datasheet.ciiva.com/7850/1018594-7850136.pdf?src-supplier=Element14
R18 = 1K: Fixed Resistor, Metal Glaze/thick Film, 0.0625W, 10000ohm, 50V, 5% +/-Tol, 100ppm/Cel, Surface Mount, 0402; Manufacturer: Yageo; Manufacturer Part Number: RC0402JR-0710KL; Additional Feature: LASER TRIMMABLE; Power: 62.5mW; Rated Temperature: 70°C; Value: 10kR; Temperature Coefficient (ppm/Cel): 100; Package Height: 0.35mm; Package Length: 1mm; Package Width: 0.5mm; Supplier: Future Electronics; Supplier Part Number: 4356762; RoHS: Yes; Category: Chip SMD Resistors; Stock: 980000; Pricing: 10000=0.0003, 50000=0.0003, 200000=0.0003, 500000=0.0003, 1250000=0.0003 (USD); Mounting Technology: Surface Mount; Pins: 2; Package Shape: Rectangular; Case/Package: 0402; Terminal Finish: Nickel; Min Operating Temperature: -55°C; Max Operating Temperature: 155°C; Tolerance: 5%; JESD-609 Code: e3; Resistor Type: FIXED RESISTOR; Construction: Chip; Packaging: Tape and Reel; Technology: METAL GLAZE/THICK FILM; Termination: Wraparound; Working Voltage: 50V; Reach SVHC Compliant: Yes; RoHS Compliant: Yes; ComponentLink1URL: https://datasheet.ciiva.com:443/pdfs/VipMasterIC/IC/YAGO/YAGO-S-A0008145938/YAGO-S-A0008145938-1.pdf?src-supplier=IHS+Markit; ComponentLink1Description: https://datasheet.ciiva.com:443/pdfs/VipMasterIC/IC/YAGO/YAGO-S-A0008145938/YAGO-S-A0008145938-1.pdf?src-supplier=IHS+Markit; ComponentLink2URL: https://datasheet.ciiva.com/2452/pyu-r-int-thick-7-2452627.pdf?src-supplier=Digikey; ComponentLink2Description: https://datasheet.ciiva.com/2452/pyu-r-int-thick-7-2452627.pdf?src-supplier=Digikey; ComponentLink3URL: https://datasheet.ciiva.com/2452/pyu-r-int-thick-7-2452628.pdf?src-supplier=Digikey; ComponentLink3Description: https://datasheet.ciiva.com/2452/pyu-r-int-thick-7-2452628.pdf?src-supplier=Digikey; ComponentLink4URL: https://datasheet.ciiva.com/2452/pyu-r-int-thick-7-2452626.pdf?src-supplier=Digikey; ComponentLink4Description: https://datasheet.ciiva.com/2452/pyu-r-int-thick-7-2452626.pdf?src-supplier=Digikey; ComponentLink5URL: https://datasheet.ciiva.com/12669/pyu-rc0402-51-rohs-l-6-r-12669687.pdf?src-supplier=Mouser; ComponentLink5Description: https://datasheet.ciiva.com/12669/pyu-rc0402-51-rohs-l-6-r-12669687.pdf?src-supplier=Mouser; ComponentLink6URL: https://datasheet.ciiva.com/7850/1018594-7850137.pdf?src-supplier=Element14; ComponentLink6Description: https://datasheet.ciiva.com/7850/1018594-7850137.pdf?src-supplier=Element14; ComponentLink7URL: https://datasheet.ciiva.com/7850/1018594-7850136.pdf?src-supplier=Element14; ComponentLink7Description: https://datasheet.ciiva.com/7850/1018594-7850136.pdf?src-supplier=Element14
U1 = BQ7791501PWR: Power Supply Support Circuit, Adjustable, 1 Channel, PDSO24; Manufacturer: Texas Instruments; Supplier: Mouser; Supplier Part Number: 595-BQ7791501PWR; Manufacturer Part Number: BQ7791501PWR; RoHS: Yes; Category: Battery Management; Stock: 7932; Pricing: 1=1.62, 10=1.19, 50=1.08, 100=0.955, 1000=0.836, 10000=0.75 (USD); ComponentLink1URL: https://www.ti.com:443/lit/ds/symlink/bq77915.pdf?src-supplier=IHS+Markit; ComponentLink1Description: https://www.ti.com:443/lit/ds/symlink/bq77915.pdf?src-supplier=IHS+Markit; ComponentLink2URL: http://www.ti.com/general/docs/suppproductinfo.tsp?distId=10&amp;gotoUrl=http%3A%2F%2Fwww.ti.com%2Flit%2Fgpn%2Fbq77915&src-supplier=Digikey; ComponentLink2Description: http://www.ti.com/general/docs/suppproductinfo.tsp?distId=10&amp;gotoUrl=http%3A%2F%2Fwww.ti.com%2Flit%2Fgpn%2Fbq77915&src-supplier=Digikey